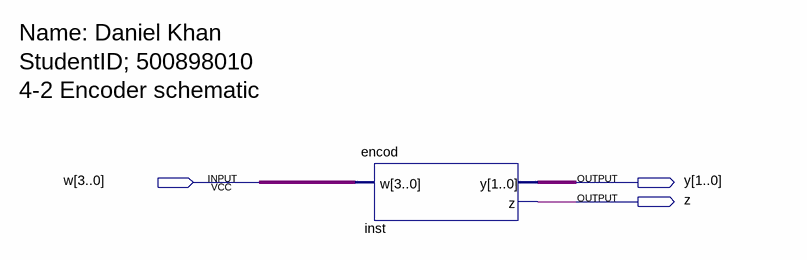
[diagram p0: schematic sheet]
// Quartus schematic encode.bdf as structural Verilog: 1 symbols, 3 pins
module encode (
  input  [3:0] w,
  output [1:0] y,
  output z
);

  encod inst (.w(w), .y(y), .z(z));

  // Notes on the sheet:
  //   Name: Daniel Khan
  //   StudentID; 500898010
  //   4-2 Encoder schematic
endmodule
